# EAGLE schematic Arduino LED:Button (EAGLE 9.4.2)
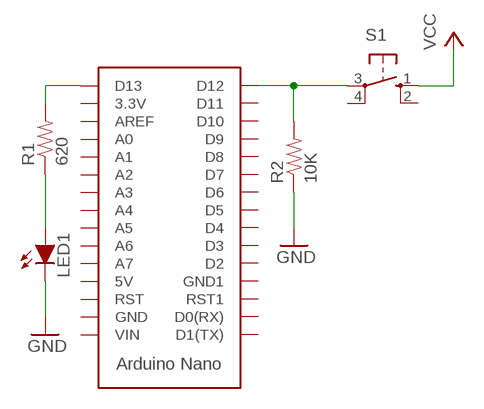
[diagram p0: schematic, sheet 1]

## Parts
LED1  LED-3MM  [LED-3MM]
R1  620  RESISTOR10W  [10W_RESISTOR_VISHAY]
R2  10K  RESISTOR10W  [10W_RESISTOR_VISHAY]
S1  BTN_10-XX  [B3F-10XX]
U$1  ARDUINO_NANO  [ARDUINO_NANO]

## Nets
GND: LED1.K(C) R2.1
N$1: R1.2 U$1.D13
N$2: LED1.A R1.1
N$3: R2.2 S1.3(P) U$1.D12
VCC: S1.1(S)
Unconnected: S1.2(S1) S1.4(P1) U$1.3.3V U$1.5V U$1.A0 U$1.A1 U$1.A2 U$1.A3 U$1.A4 U$1.A5 U$1.A6 U$1.A7 U$1.AREF U$1.D0(RX) U$1.D1(TX) U$1.D2 U$1.D3 U$1.D4 U$1.D5 U$1.D6 U$1.D7 U$1.D8 U$1.D9 U$1.D10 U$1.D11 U$1.GND U$1.GND1 U$1.RST U$1.RST1 U$1.VIN

## Library data of the parts
LED1 = HyTechDevices:LED: Light Emitting Diode (LED) Source: Dangerous Prototypes Eagle Library <https://github.com/DangerousPrototypes/Eagle_Part_Library>
R1 R2 = HyTechDevices:RESISTOR: Resistor Basic schematic elements and footprints for 0603, 1206, and PTH resistors.
S1 = HyTechDevices:BTN_10-XX: Small momentary tactile push button; MPN: B3F-1000; OC_FARNELL: 176432; OC_NEWARK: 36M3542
U$1 = HyTechDevices:ARDUINO_NANO: Arduino Nano Device Specifications <https://www.arduino.cc/en/Main/ArduinoBoardNano> Pinout Diagram <http://pighixxx.com/nanopdf.pdf>